# Altium schematic sheet Esquema_general.SchDoc
size A4
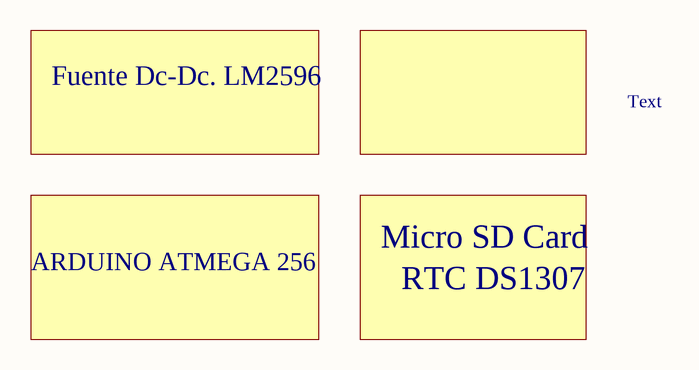
[diagram p0: Esquema_general.SchDoc]

## Notes on the sheet
- Fuente Dc-Dc. LM2596
- Text
- ARDUINO ATMEGA 256
- Micro SD Card
- RTC DS1307